# Altium schematic sheet AMU-S31-V00-Peripherals.SchDoc
size A3; SheetNumber: 18; SheetTotal: 18
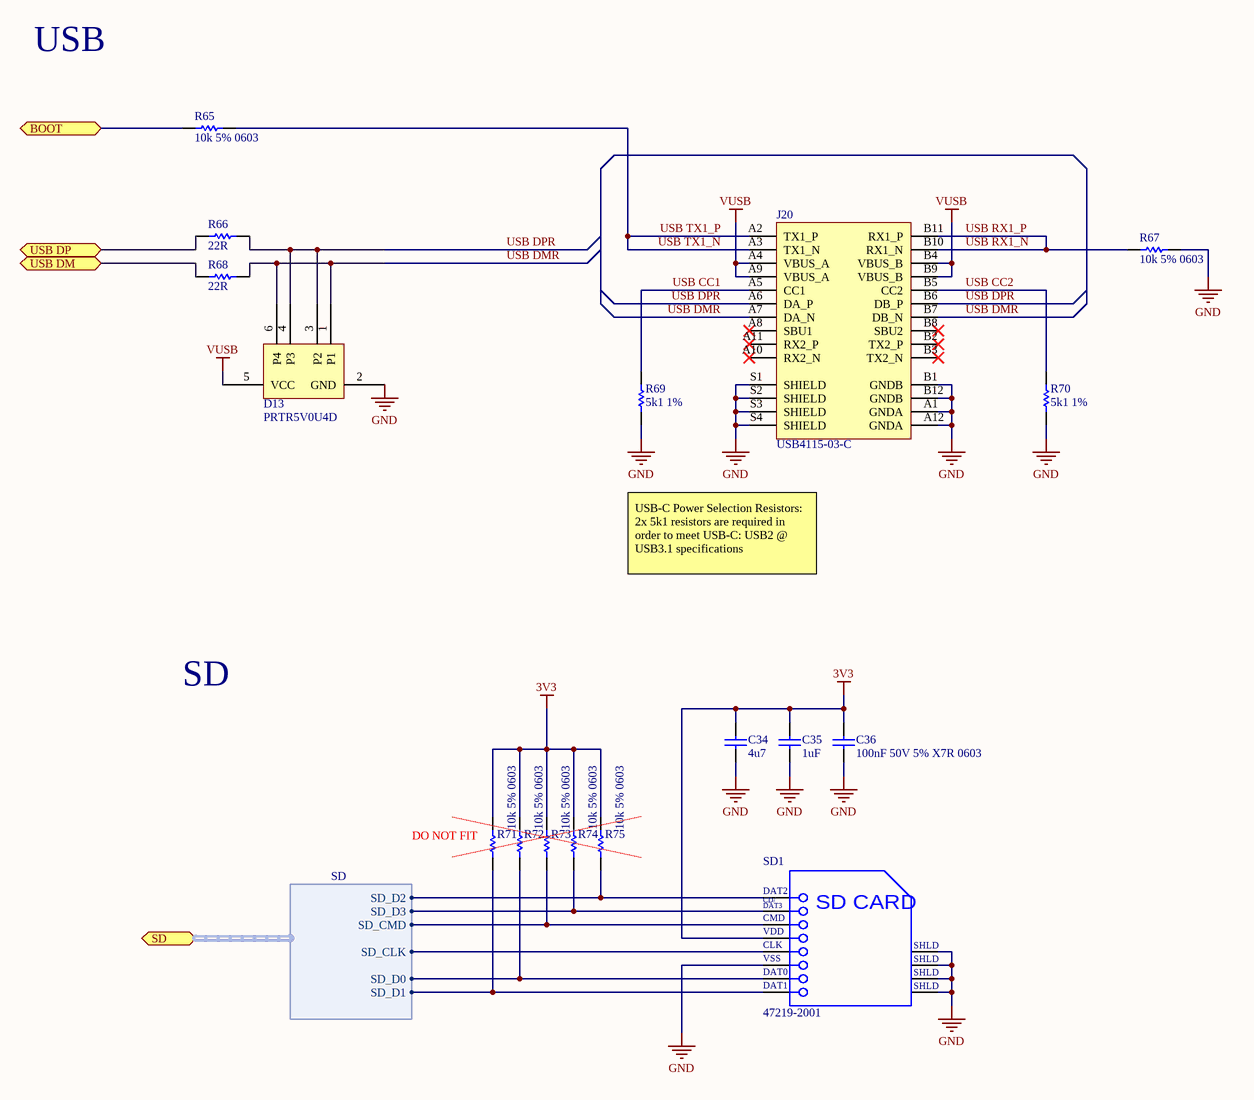
[diagram p0: AMU-S31-V00-Peripherals.SchDoc]

## Parts
C34  4u7  [Cap_Ceramic_0603]
C35  1uF  [Cap_Ceramic_0603]
C36  100nF 50V 5% X7R 0603  [Cap_Ceramic_0603]
D13  PRTR5V0U4D  [SC-47]
J20  USB4115-03-C  [USB4115-03-C]
R65  10k 5% 0603  [Res_ThinFilm_0603]
R66  22R  [Res_ThinFilm_0603]
R67  10k 5% 0603  [Res_ThinFilm_0603]
R68  22R  [Res_ThinFilm_0603]
R69  5k1 1%  [Res_ThinFilm_0603]
R70  5k1 1%  [Res_ThinFilm_0603]
R71  10k 5% 0603  [Res_ThinFilm_0603]
R72  10k 5% 0603  [Res_ThinFilm_0603]
R73  10k 5% 0603  [Res_ThinFilm_0603]
R74  10k 5% 0603  [Res_ThinFilm_0603]
R75  10k 5% 0603  [Res_ThinFilm_0603]
SD1  47219-2001  [MOLX-47219-2001-8_V]

## Ports
BOOT (bidir), SD (bidir, harness SD), USB DM (bidir), USB DP (bidir)

## Harnesses
SD: SD_D2, SD_D3, SD_CMD, SD_CLK, SD_D0, SD_D1

## Nets
3V3: C34.2 C35.2 C36.2 R71.2 R72.2 R73.2 R74.2 R75.2 SD1.4(VDD)
GND: C34.1 C35.1 C36.1 D13.2(GND) J20.A1(GNDA) J20.A12(GNDA) J20.B1(GNDB) J20.B12(GNDB) J20.S1(SHIELD) J20.S2(SHIELD) J20.S3(SHIELD) J20.S4(SHIELD) R67.2 R69.1 R70.1 SD1.6(VSS) SD1.9(SHLD) SD1.10(SHLD) SD1.11(SHLD) SD1.12(SHLD)
VUSB: D13.5(VCC) J20.A4(VBUS_A) J20.A9(VBUS_A) J20.B4(VBUS_B) J20.B9(VBUS_B)
BOOT: R65.2 ; port BOOT
USB CC1: J20.A5(CC1) R69.2
USB CC2: J20.B5(CC2) R70.2
USB DM: R68.1 ; port USB DM
USB DMR: D13.1(P1) D13.6(P4) J20.A7(DA_N) J20.B7(DB_N) R68.2
USB DP: R66.1 ; port USB DP
USB DPR: D13.3(P2) D13.4(P3) J20.A6(DA_P) J20.B6(DB_P) R66.2
USB RX1_N: J20.B10(RX1_N) J20.B11(RX1_P) R67.1  [also labelled USB RX1_P]
USB TX1_N: J20.A2(TX1_P) J20.A3(TX1_N) R65.1  [also labelled USB TX1_P]
NetR71_1: R71.1 SD1.8(DAT1) ; port SD.SD_D1
NetR72_1: R72.1 SD1.7(DAT0) ; port SD.SD_D0
NetR73_1: R73.1 SD1.3(CMD) ; port SD.SD_CMD
NetR74_1: R74.1 SD1.2(CD/DAT3) ; port SD.SD_D3
NetR75_1: R75.1 SD1.1(DAT2) ; port SD.SD_D2
NetSD1_5: SD1.5(CLK) ; port SD.SD_CLK

Not connected (* = marked no-connect by the designer): J20 A8(SBU1)* A10(RX2_N)* A11(RX2_P)* B2(TX2_P)* B3(TX2_N)* B8(SBU2)*

## Notes on the sheet
- USB
- USB-C Power Selection Resistors:
  2x 5k1 resistors are required in order to meet USB-C: USB2 @ USB3.1 specifications
- SD
- (near R71) DO NOT FIT
- (in symbol CMP-2000-05245-1) CD/; DAT3; SD CARD

## Library data of the parts
C34 = 4u7 50V 5% X7R 0603: Capacitor, Ceramic, SMD, 4u7, 50V, 5%, X7R, 0603
C35 = 1uF 25V 5% X7R 0603: Capacitor, Ceramic, SMD, 1uF, 25V, 5%, X7R, 0603
C36 = 100nF 50V 5% X7R 0603: Capacitor, Ceramic, SMD, 100nF, 50V, 5%, X7R, 0603
D13 = PRTR5V0U4D: Clamp Ipp Tvs Diode Surface Mount 6-TSOP
J20 = USB4115-03-C: USB-C (USB TYPE-C) USB 3.2 Gen 2 (USB 3.1 Gen 2, Superspeed + (USB 3.1)) Receptacle Connector 24 Position Surface Mount, Through Hole
R65 R67 R71-R75 = 10k 5% 0603: Resistor, SMD, 10k, 0.1W, 5%, 0603
R66 R68 = 22R 5% 0603: Resistor, SMD, 22R, 0.1W, 5%, 0603
R69 R70 = 5k1 1% 0603: Resistor, SMD, 5k1, 0.1W, 1%, 0603
SD1 = CMP-2000-05245-1: MicroSD Card Connector, Hinge Type, -40 to 85 degC, 8-Pin SMD, RoHS, Tape and Reel; Manufacturer: Molex; Current Rating: 500mA; Number of Contacts: 8; Pitch: 1.09mm; Insertion - Extraction Style: Hinged; Voltage Rating: 100VDC; Product: CardConnectors; Contact Material: CopperAlloy; Series: 47219; Packaging: Reel; Brand: Molex; Product Category: MemoryCardConnectors; Housing Material: Thermoplastic; Mounting Style: SMD/SMT; Termination Style: SMD; Datasheet Version: Rev. F, 06/2009; Card Type: microSD; Manufacturer URL: http://www.molex.com/; RoHS: Details; Datasheet URL: http://www.molex.com/pdm_docs/sd/472192001_sd.pdf; Factory Pack Quantity: 2400